# EAGLE design stereo-amp-rev1 (EAGLE 5.10)
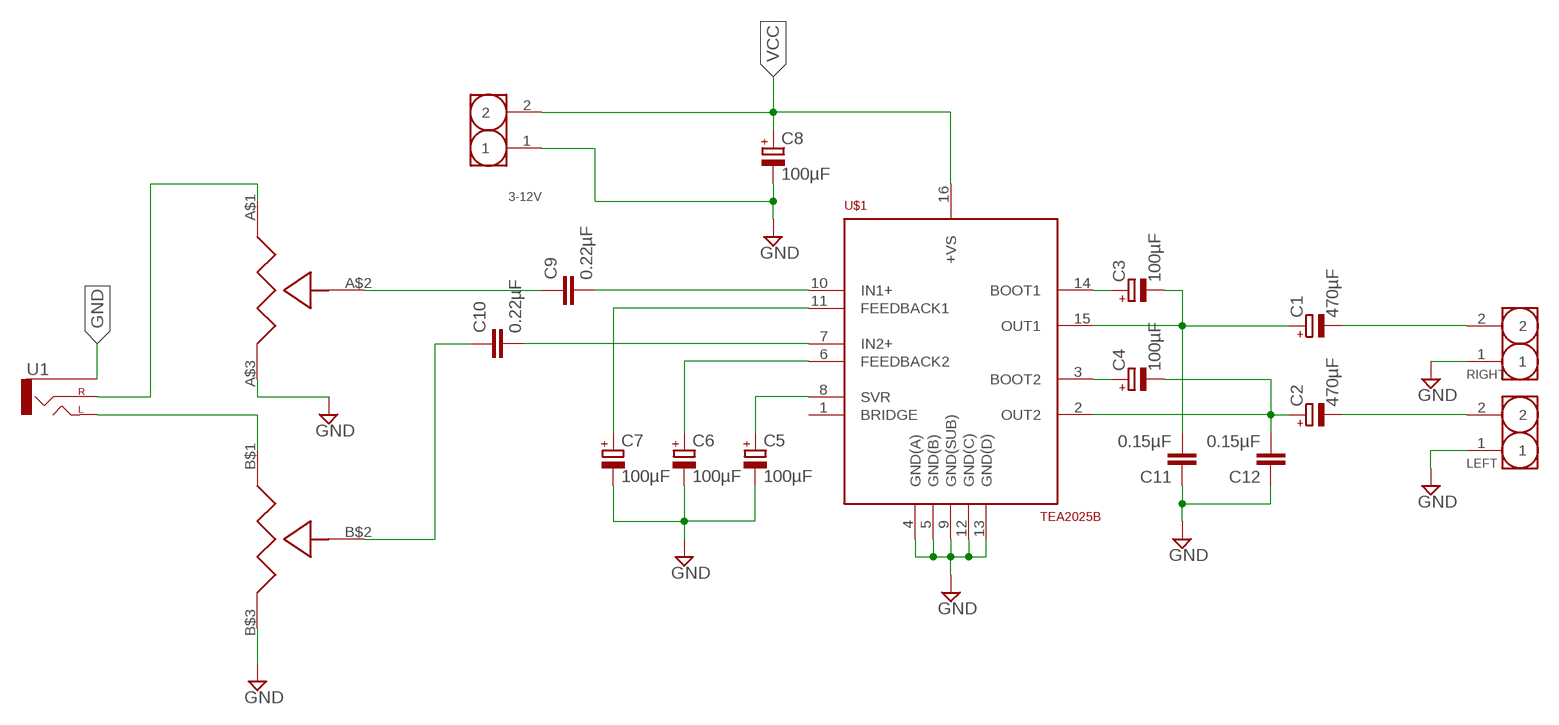
[diagram p0: schematic, sheet 1]

## Parts
3-12V  HEADER-2P-2.54  [2P-2.54]
C1  470µF  CPOL-EUE2.5-7  [E2,5-7]
C2  470µF  CPOL-EUE2.5-7  [E2,5-7]
C3  100µF  CPOL-EUE2.5-7  [E2,5-7]
C4  100µF  CPOL-EUE2.5-7  [E2,5-7]
C5  100µF  CPOL-EUE2.5-7  [E2,5-7]
C6  100µF  CPOL-EUE2.5-7  [E2,5-7]
C7  100µF  CPOL-EUE2.5-7  [E2,5-7]
C8  100µF  CPOL-EUE2.5-7  [E2,5-7]
C9  0.22µF  C-EU050-024X044  [C050-024X044]
C10  0.22µF  C-EU050-024X044  [C050-024X044]
C11  0.15µF  C-EU050-024X044  [C050-024X044]
C12  0.15µF  C-EU050-024X044  [C050-024X044]
LEFT  HEADER-2P-2.54  [2P-2.54]
RIGHT  HEADER-2P-2.54  [2P-2.54]
U1  AUDIO-JACKPTH  [AUDIO-JACK]
U$1  TEA2025B  [DIL16]
U$2  POT_10K  POT_TYPE27  [POT_TYPE27]

## Nets
GND: 3-12V.1 C5.- C6.- C7.- C8.- C11.1 C12.1 LEFT.1 RIGHT.1 U1.SLEEVE U$1.4(GND(A)) U$1.5(GND(B)) U$1.9(GND(SUB)) U$1.12(GND(C)) U$1.13(GND(D)) U$2.A$3 U$2.B$3(A$3)
N$1: C9.2 U$1.10(IN1+)
N$2: C10.2 U$1.7(IN2+)
N$3: C7.+ U$1.11(FEEDBACK1)
N$4: C6.+ U$1.6(FEEDBACK2)
N$5: C5.+ U$1.8(SVR)
N$6: C3.+ U$1.14(BOOT1)
N$7: C4.+ U$1.3(BOOT2)
N$8: C1.+ C3.- C11.2 U$1.15(OUT1)
N$9: C2.+ C4.- C12.2 U$1.2(OUT2)
N$10: C1.- RIGHT.2
N$11: C2.- LEFT.2
N$12: U1.TIP(LEFT) U$2.B$1(A$1)
N$13: U1.RING(RIGHT) U$2.A$1
N$14: C10.1 U$2.B$2(A$2)
N$15: C9.1 U$2.A$2
VCC: 3-12V.2 C8.+ U$1.16(+VS)
Unconnected: U$1.1(BRIDGE)

## Library data of the parts
3-12V LEFT RIGHT = Seeed-Connector:HEADER-2P
C1-C8 = rcl:CPOL-EU: POLARIZED CAPACITOR, European symbol
C9-C12 = rcl:C-EU: CAPACITOR, European symbol
U1 = SparkFun:AUDIO-JACK: 3.5mm Audio Jack Simple 3.5mm common PCB mount audio jack. SKU: PRT-08032
U$1 = build-electronic-circuits:TEA2025B
U$2 = build-electronic-circuits:POT_TYPE27: TE CONNECTIVITY / CITEC - 27ESB104MMF50N POTENTIOMETER, DUAL GANG, 100K, LOG Farnell item number: 1898451

## Board
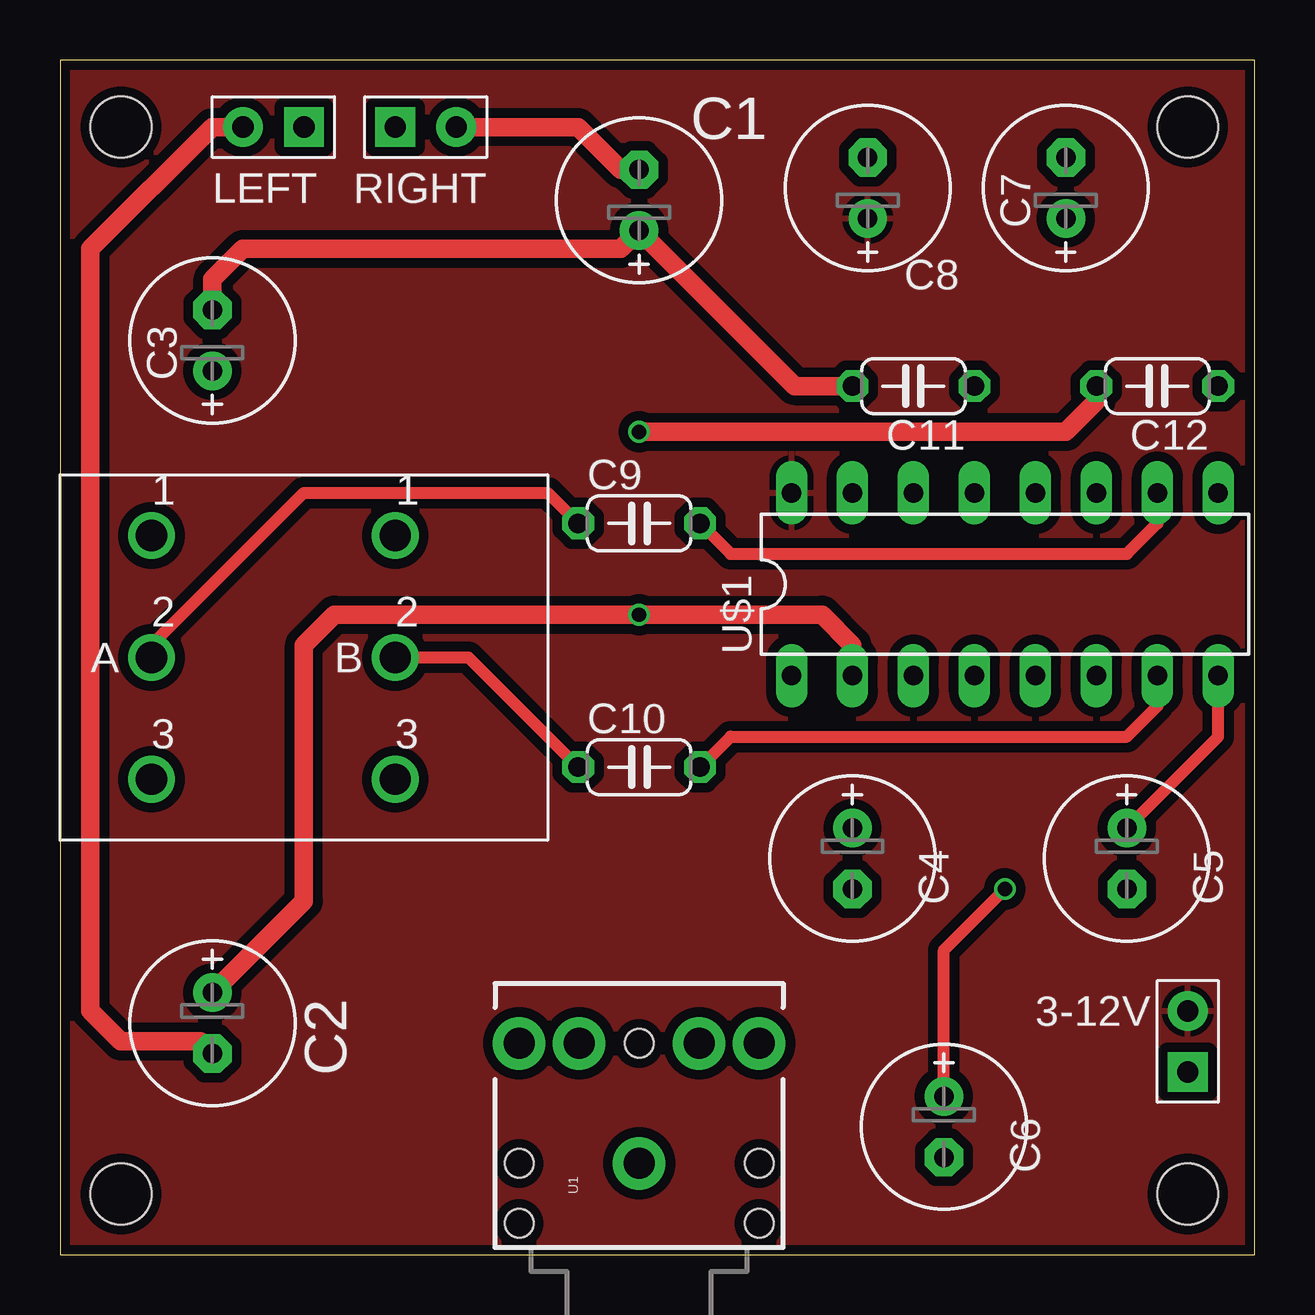
[diagram p1: board, top side]
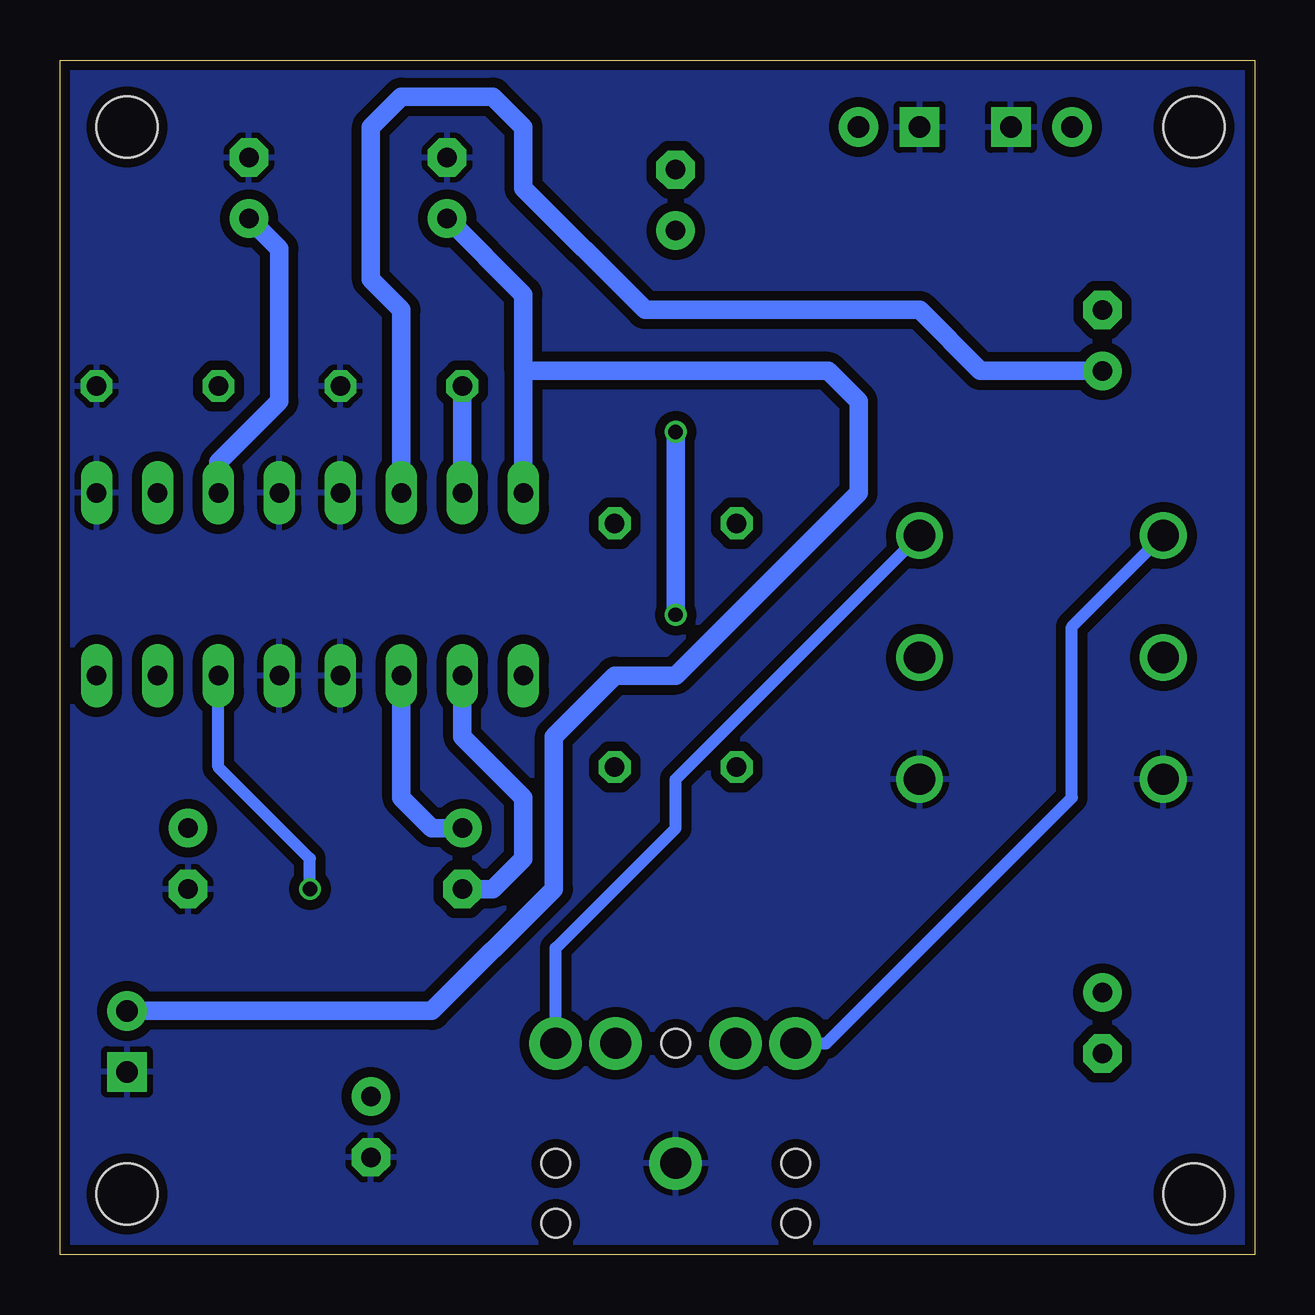
[diagram p2: board, bottom side, seen from below]

Size 49.78 x 49.78 mm. Coordinates in mm from the lower left corner, seen from the top.
Outline: 0,0 49.78,0 49.78,49.78 0,49.78 0,0
Copper layers (1*16): Top 0.035mm / dielectric 1.5mm / Bottom 0.035mm
Design rules "Fusion_eagle_rule_v1.1": minimum track width 6mil, minimum drill 12mil, track to track 6mil, track to pad 6mil, pad to pad 6mil, via to via 6mil, smd to smd 0mil, copper to edge 10mil, drill to drill 10mil, minimum pad ring 10mil, minimum via ring 6mil, stop-mask expansion 2mil, vias tented up to drill 100mil, thermal gap 10mil
Holes 2.54 mm at 2.54,46.99 46.99,46.99 46.99,2.54 2.54,2.54

### Footprints (pad centres in the part's own frame; a part is rotated, then mirrored left to right if it is on the bottom)
2P-2.54 = drill 0.889 pad 1.651 square: 1 0,1.27 | drill 0.889 pad 1.651 round: 2 0,-1.27
E2,5-7 = drill 0.813 pad 1.6 round: + -1.27,0 | drill 0.813 pad 1.6 octagon: - 1.27,0
C050-024X044 = drill 0.813 octagon: 1 -2.54,0; 2 2.54,0
AUDIO-JACK = drill 1.3 pad 2.184 round: RING 5,5; RSH 5,2.5; SLEEVE 0,0; TIP 5,-5; TSH 5,-2.5 | hole 1.2: 0,5; -2.5,5; -2.5,-5; 0,-5; 5,0
DIL16 = drill 0.813 long: 1 -8.89,-3.81; 2 -6.35,-3.81; 3 -3.81,-3.81; 4 -1.27,-3.81; 5 1.27,-3.81; 6 3.81,-3.81; 7 6.35,-3.81; 8 8.89,-3.81; 9 8.89,3.81; 10 6.35,3.81; 11 3.81,3.81; 12 1.27,3.81; 13 -1.27,3.81; 14 -3.81,3.81; 15 -6.35,3.81; 16 -8.89,3.81
POT_TYPE27 = drill 1.3 round: A$1 -5.08,5.08; A$2 -5.08,0; A$3 -5.08,-5.08; B$1 5.08,5.08; B$2 5.08,0; B$3 5.08,-5.08

### Placement (x,y rotation side)
3-12V  46.99,8.89 180 top
C1  24.13,43.94 90 top
C2  6.35,9.65 270 top
C3  6.35,38.1 90 top
C4  33.02,16.51 270 top
C5  44.45,16.51 270 top
C6  36.83,5.33 270 top
C7  41.91,44.45 90 top
C8  33.66,44.45 90 top
C9  24.13,30.48 0 top
C10  24.13,20.32 0 top
C11  35.56,36.2 180 top
C12  45.72,36.2 180 top
LEFT  8.89,46.99 270 top
RIGHT  15.24,46.99 90 top
U1  24.13,3.81 90 top
U$1  39.37,27.94 0 top
U$2  8.89,24.89 0 top

### Tracks (layer width: path | path; a pad name or v marks a point on that pad's centre or on a via)
GND
  pour Bottom (isolate 0.406): 0.25,0.25 0.25,49.53 49.53,49.53 49.53,0.25
N$1
  Top 0.508: U$1.10 45.72,30.48 44.45,29.21 27.94,29.21 C9.2
N$2
  Top 0.508: C10.2 27.94,21.59 44.45,21.59 45.72,22.86 U$1.7
N$3
  Bottom 0.762: U$1.11 43.18,33.02 40.64,35.56 40.64,41.91 C7.+
N$4  (via drill 0.6)
  Top 0.508: C6.+ 36.83,12.7 v39.37,15.24
  Bottom 0.508: v39.37,15.24 39.37,16.51 43.18,20.32 U$1.6
N$5
  Top 0.508: C5.+ 45.72,19.05 48.26,21.59 U$1.8
N$6
  Bottom 0.762: U$1.14 35.56,39.37 36.83,40.64 36.83,46.99 35.56,48.26 31.75,48.26 30.48,46.99 30.48,44.45 25.4,39.37 13.97,39.37 11.43,36.83 C3.+
N$7
  Bottom 0.762: C4.+ 34.29,17.78 35.56,19.05 U$1.3
N$8
  Top 0.762: C11.2 30.61,36.2 C1.+ 23.37,41.91 7.62,41.91 6.35,40.64 C3.-
  Bottom 0.762: C11.2 U$1.15
N$9  (via drill 0.6)
  Top 0.762: C12.2 43.18,35.56 41.91,34.29 v24.13,34.29 | U$1.2 33.02,25.4 31.75,26.67 v24.13,26.67 11.43,26.67 10.16,25.4 10.16,14.73 C2.+
  Bottom 0.762: v24.13,26.67 v24.13,34.29 | C4.- 31.75,15.24 30.48,16.51 30.48,19.05 33.02,21.59 U$1.2
N$10
  Top 0.762: C1.- 23.37,45.21 21.59,46.99 RIGHT.2
N$11
  Top 0.762: LEFT.2 6.35,46.99 1.27,41.91 1.27,10.16 2.54,8.89 5.84,8.89 C2.-
N$12
  Bottom 0.508: U1.TIP 29.13,12.78 24.13,17.78 24.13,19.81 U$2.B$1
N$13
  Bottom 0.508: U1.RING 17.86,8.81 7.62,19.05 7.62,26.16 U$2.A$1
N$14
  Top 0.508: U$2.B$2 17.02,24.89 C10.1
N$15
  Top 0.508: U$2.A$2 3.81,25.4 10.16,31.75 20.32,31.75 C9.1
VCC
  Bottom 0.762: 30.48,36.83 U$1.16 | 30.48,36.83 30.48,40.01 C8.+ | 3-12V.2 34.29,10.16 29.21,15.24 29.21,21.59 26.67,24.13 24.13,24.13 16.51,31.75 16.51,35.56 17.78,36.83 30.48,36.83
  pour Top (isolate 0.406): 0.25,0.25 0.25,49.53 49.53,49.53 49.53,0.25